# EAGLE design arduino adapter (EAGLE 5.03)
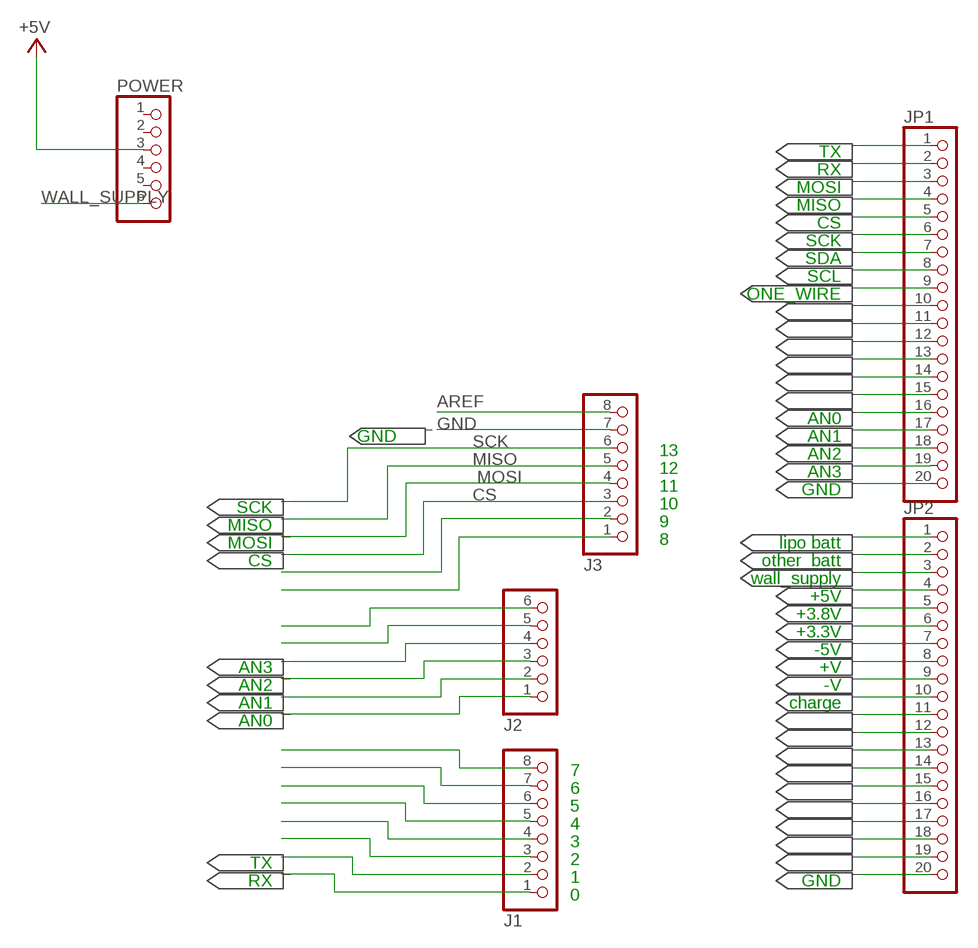
[diagram p0: schematic, sheet 1]

## Parts
J1  PINHD-1X8  [1X08]
J2  PINHD-1X6  [1X06]
J3  PINHD-1X8  [1X08]
JP1  PINHD-1X20  [1X20]
JP2  PINHD-1X20  [1X20]
POWER  PINHD-1X6  [1X06]

## Nets
+3.3V: JP2.6
+5V [usbvcc]: JP2.4 POWER.3
+V: JP2.8
-5V: JP2.7
-V: JP2.9
ALARM: JP1.14
AN0: J2.1 JP1.16
AN1: J2.2 JP1.17
AN2: J2.3 JP1.18
AN3: J2.4 JP1.19
AREF [aref]: J3.8
CD: JP1.10
CHARGE: JP2.10
CS: J3.3 JP1.5
GND [gnd]: J3.7 JP1.20 JP2.20
LOG: JP1.12
MISO: J3.5 JP1.4
MOSI: J3.4 JP1.3
N$1: JP2.11
N$4: JP2.12
N$5: J3.1
N$10: J1.3
N$11: J1.4
N$12: J1.5
N$13: J1.6
N$14: J1.7
N$15: J1.8
N$20: J2.5
N$21: J2.6
N$22: J3.2
N$23: JP2.13
N$28: JP2.14
N$29: JP2.15
N$30: JP2.16
N$31: JP2.17
N$33: JP2.18
N$41: JP2.19
N$42: JP1.15
ONE_WIRE: JP1.9
RIN: JP1.13
RX: J1.1 JP1.2
SCK: J3.6 JP1.6
SCL: JP1.8
SDA: JP1.7
SW: JP1.11
TX: J1.2 JP1.1
VCC1: JP2.5
VDD: JP2.1 JP2.2
WALL_SUPPLY: JP2.3 POWER.6
Unconnected: POWER.1 POWER.2 POWER.4 POWER.5

## Notes on the sheet
- TX
- RX
- MOSI
- MISO
- CS
- SCK
- SDA
- SCL
- ONE_WIRE
- AN0
- GND | AN1
- AN2
- 13
- AN3
- 12
- GND
- 11
- SCK
- 10
- MISO
- 9
- MOSI | lipo batt
- 8
- CS | other_batt
- wall_supply
- +5V
- +3.8V
- +3.3V
- -5V
- AN3 | +V
- AN2 | -V
- AN1 | charge
- AN0
- 7
- 6
- 5
- 4
- 3
- TX
- 2
- RX | GND
- 1
- 0

## Library data of the parts
J1 J3 = pinhead:PINHD-1X8: PIN HEADER
J2 POWER = pinhead:PINHD-1X6: PIN HEADER
JP1 JP2 = pinhead:PINHD-1X20: PIN HEADER

## Net classes
1 power: width 0.61 mm, drill 0.711 mm, clearance 0.33 mm
2 gnd: width 0.305 mm, drill 0.711 mm, clearance 0.254 mm
3 usbvcc: width 0.508 mm, drill 0.711 mm, clearance 0.254 mm
4 aref: width 0.406 mm

## Board
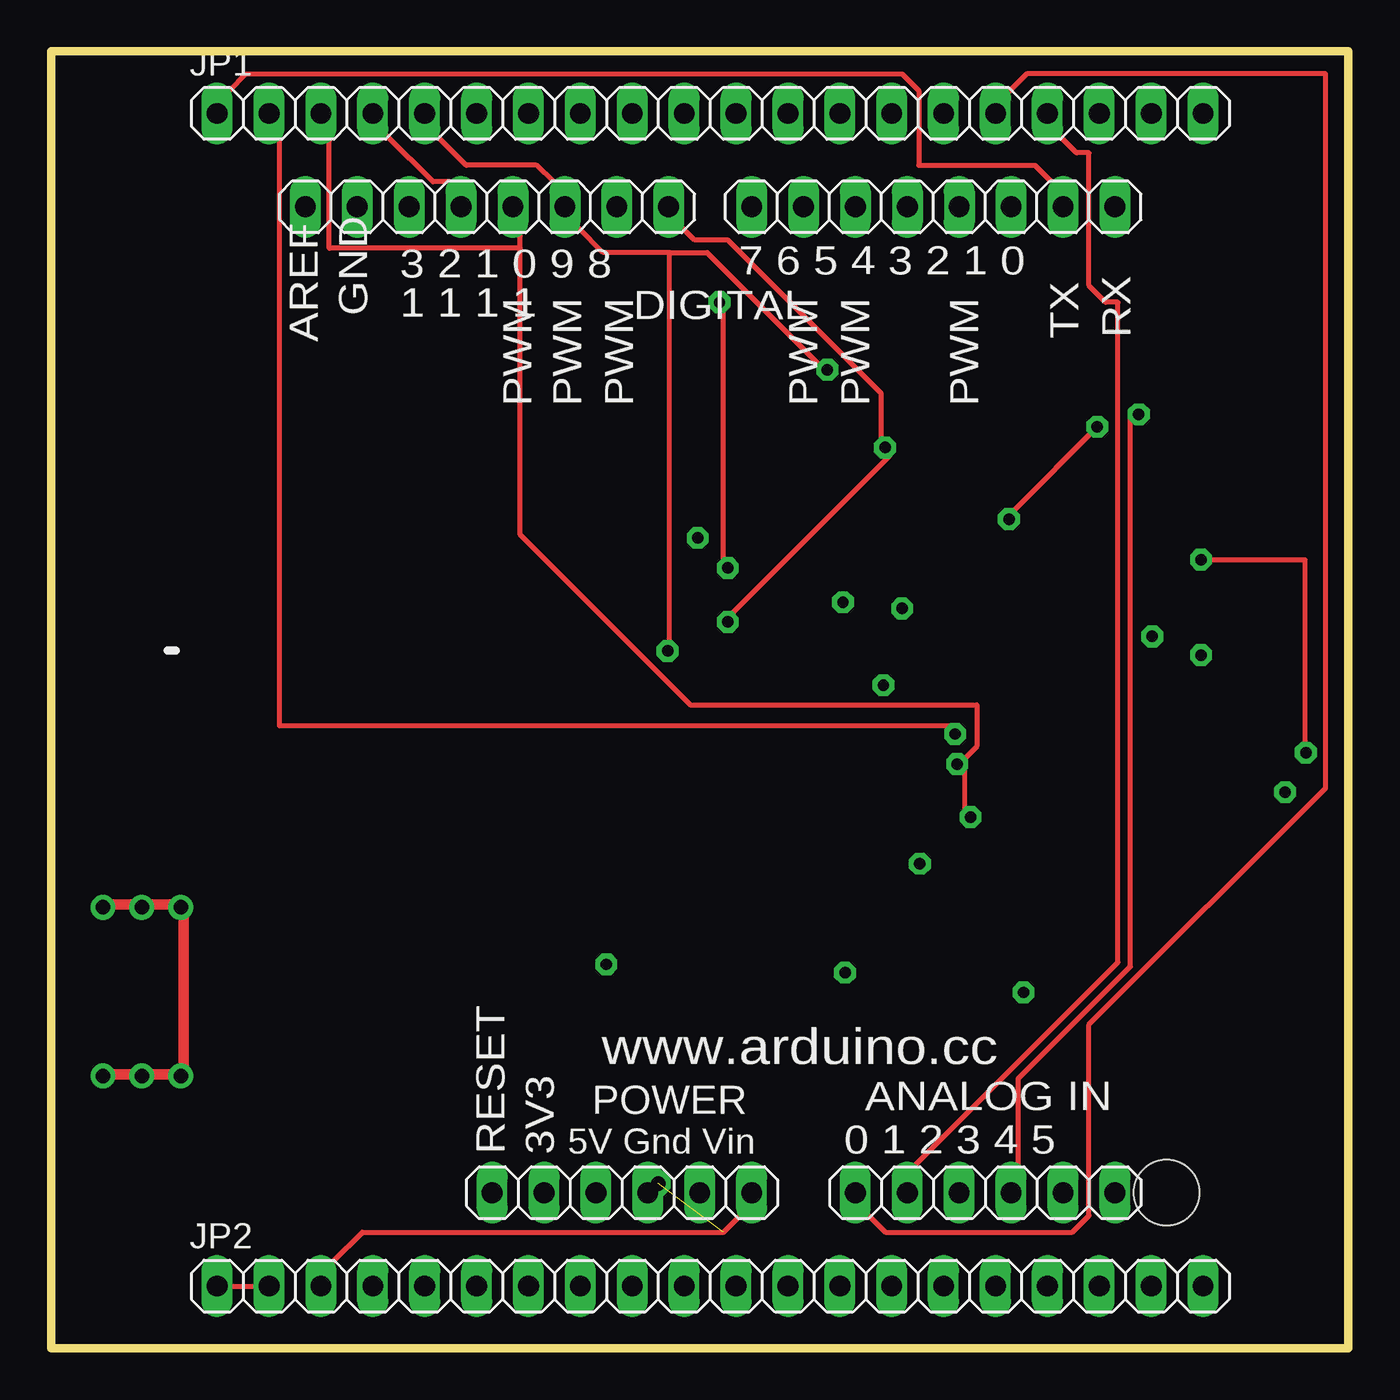
[diagram p1: board, top side]
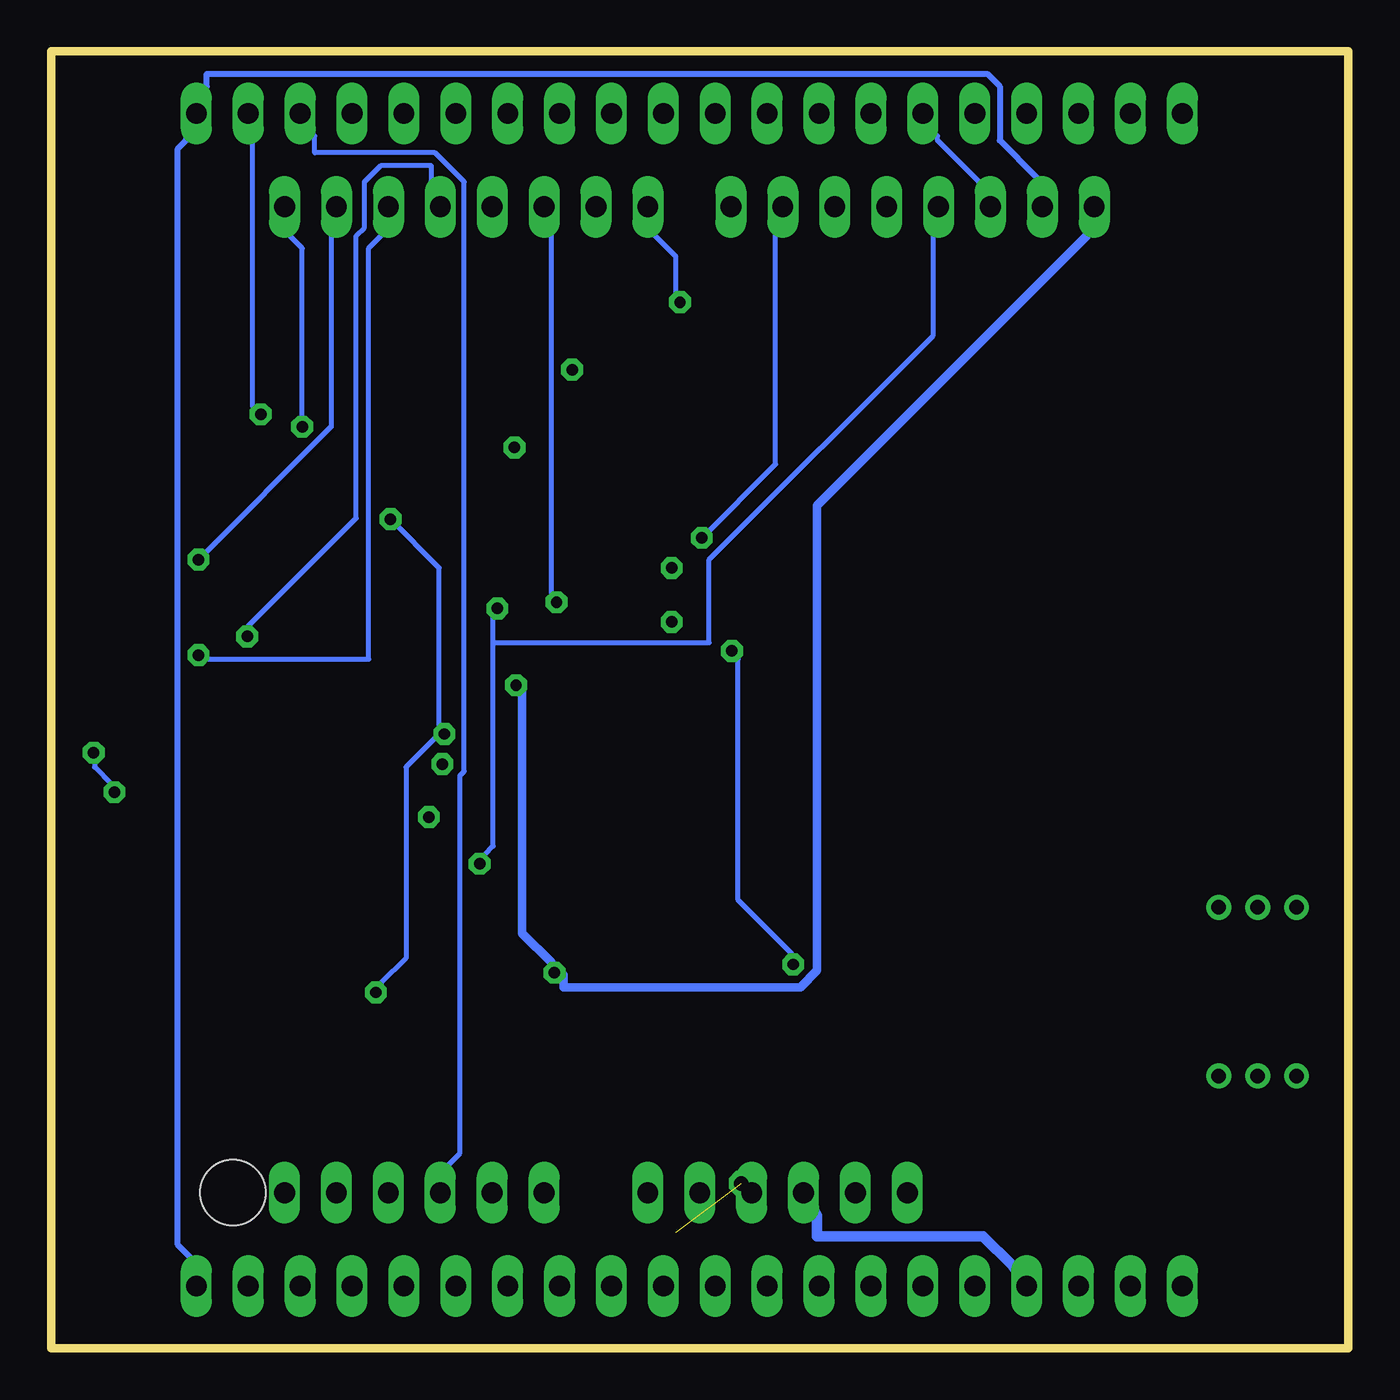
[diagram p2: board, bottom side, seen from below]

Size 63.5 x 63.5 mm. Coordinates in mm from the lower left corner, seen from the top.
Outline: 0,63.5 63.5,63.5 63.5,0 0,0 0,63.5
Copper layers (1*16): Top 0.035mm / dielectric 1.5mm / Bottom 0.035mm
Design rules "default": minimum track width 10mil, minimum drill 22mil, track to track 10mil, track to pad 10mil, pad to pad 10mil, via to via 16mil, smd to smd 8mil, copper to edge 30mil, drill to drill 12mil, minimum pad ring 10mil, minimum via ring 10mil, stop-mask expansion 4mil, vias tented up to drill 0mil, thermal gap 10mil
Holes 3.2 mm at 54.61,7.62
vRestrict: area 22.9,44.1 to 24.6,49.1; area 25.4,45.5 to 27.1,49.1; area 28.4,45.3 to 29.6,48.8; area 31,45.3 to 32.1,48.8; area 33.5,45.3 to 34.7,48.8; area 36.1,45.3 to 37.2,48.8; area 38.7,47.2 to 39.9,48.8; area 40.3,45.1 to 47.6,46.9; area 33.4,41 to 34.9,44.6; area 35.9,41 to 37.5,44.6; area 38.5,41 to 40,44.6; area 47.5,41 to 49,44.6; 37 more areas

### Footprints (pad centres in the part's own frame; a part is rotated, then mirrored left to right if it is on the bottom)
1X08 = drill 1.016 long: 1 -8.89,0; 2 -6.35,0; 3 -3.81,0; 4 -1.27,0; 5 1.27,0; 6 3.81,0; 7 6.35,0; 8 8.89,0
1X06 = drill 1.016 long: 1 -6.35,0; 2 -3.81,0; 3 -1.27,0; 4 1.27,0; 5 3.81,0; 6 6.35,0
1X20 = drill 1.016 long: 1 -24.13,0; 2 -21.59,0; 3 -19.05,0; 4 -16.51,0; 5 -13.97,0; 6 -11.43,0; 7 -8.89,0; 8 -6.35,0; 9 -3.81,0; 10 -1.27,0; 11 1.27,0; 12 3.81,0; 13 6.35,0; 14 8.89,0; 15 11.43,0; 16 13.97,0; 17 16.51,0; 18 19.05,0; 19 21.59,0; 20 24.13,0

### Placement (x,y rotation side)
J1  43.18,55.88 180 top
J2  45.72,7.62 0 top
J3  21.34,55.88 180 top
JP1  32.26,60.45 0 top
JP2  32.26,3.05 0 top
POWER  27.94,7.62 0 top

### Tracks (layer width: path | path; a pad name or v marks a point on that pad's centre or on a via)
+5V
  Bottom 0.508: JP2.4 16.46,4.06 17.88,5.49 26.01,5.49 26.01,6.5 POWER.3
AN0
  Top 0.254: J2.1 40.03,6.5 40.84,5.69 49.99,5.69 50.8,6.5 50.8,15.85 62.38,27.43 62.38,62.38 47.75,62.38 46.94,61.57 JP1.16
AN1
  Top 0.254: J2.2 42.27,8.94 52.22,18.9 52.22,51.21 51.61,51.21 50.8,52.02 50.8,58.52 50.19,58.52 49.38,59.33 JP1.17
AN2
  Bottom 0.254: J2.3 44.09,8.94 43.48,9.55 43.48,28.04 43.28,28.25 43.28,57.1 44.7,58.52 50.6,58.52 50.6,59.33 JP1.18
AN3  (via drill 0.56)
  Top 0.254: v53.24,45.72 52.83,45.72 52.83,18.69 47.35,13.21 47.35,8.94 J2.4
  Bottom 0.254: v53.24,45.72 53.65,46.13 53.65,59.13 JP1.19
AREF  (via drill 0.56)
  Bottom 0.406: v40.74,32.46 40.44,32.11 40.44,20.32 39.01,18.9 v38.86,18.39 38.41,18.29 38.41,17.68 26.82,17.68 26.01,18.49 26.01,41.25 12.8,54.46 J3.8
CS  (via drill 0.56)
  Top 0.254: 30.28,53.65 27.03,53.65 25.81,54.86 J3.3 24.59,57.1 23.77,57.91 20.32,57.91 18.9,59.33 JP1.5 | 30.28,53.65 32.11,53.65 37.59,48.16 v38,47.9 | 30.28,53.65 30.28,34.54 v30.18,34.14
  Bottom 0.254: v27.18,18.8 27.23,19.3 29.87,21.95 29.87,33.73 v30.18,34.14
GND
  Bottom 0.305: JP2.20 56.69,4.47 57.3,5.08 57.3,58.73 56.9,59.13 JP1.20 55.88,61.77 55.88,62.38 17.68,62.38 17.07,61.77 17.07,59.13 15.24,57.3 J3.7
MISO  (via drill 0.56)
  Top 0.254: JP1.4 16.46,59.33 18.69,57.1 19.51,57.1 J3.5
  Bottom 0.254: 41.86,34.54 41.86,35.76 v41.66,36.22 | 41.86,34.54 41.86,24.59 42.27,24.18 v42.52,23.72 | 41.86,34.54 31.29,34.54 31.29,38.61 20.32,49.58 20.32,54.46 J3.5
MOSI  (via drill 0.56)
  Top 0.254: v45.01,26.01 44.7,26.42 44.7,28.25 v44.35,28.6 44.7,28.85 45.31,29.46 45.31,31.5 31.29,31.5 22.96,39.83 22.96,53.85 | 22.96,53.85 22.96,54.46 J3.4 | 22.96,53.85 13.61,53.85 13.61,59.13 JP1.3
N$5  (via drill 0.56)
  Top 0.254: v33.12,35.56 33.33,35.97 41.05,43.69 v40.82,44.09 40.64,44.5 40.64,46.74 33.12,54.25 31.5,54.25 30.89,54.86 J3.1
N$10  (via drill 0.56)
  Bottom 0.254: v56.29,33.93 55.88,33.73 47.95,33.73 47.95,53.85 47.35,54.46 J1.3
N$11  (via drill 0.56)
  Bottom 0.254: v53.9,34.85 53.85,35.36 48.56,40.64 48.56,54.46 48.16,54.86 48.16,57.1 47.35,57.91 44.91,57.91 44.91,57.1 J1.4
N$13  (via drill 0.56)
  Bottom 0.254: v38.76,36.52 39.01,36.98 39.01,54.46 J1.6
N$15  (via drill 0.56)
  Top 0.254: v33.12,38.2 32.92,38.61 32.92,50.8 v32.72,51.21
  Bottom 0.254: J1.8 33.93,54.46 32.92,53.44 32.92,51.61 v32.72,51.21
N$22  (via drill 0.56)
  Bottom 0.254: v31.65,39.67 28.04,43.28 28.04,54.46 J3.2
RX  (via drill 0.56)
  Top 0.254: v51.21,45.11 47.14,41.05 v46.89,40.59 | JP1.2 11.18,59.13 11.18,30.48 44.09,30.48 v44.25,30.07
  Bottom 0.254: v47.6,17.42 47.35,17.88 46.13,19.1 46.13,28.45 44.7,29.87 v44.25,30.07 44.5,30.48 44.5,38.2 v46.89,40.59 | v51.21,45.11 51.21,53.85 51.82,54.46 J1.1
SCK
  Bottom 0.254: J3.6 18.09,57.1 20.12,59.13 20.12,59.33 JP1.6
TX  (via drill 0.56)
  Top 0.254: v56.29,38.61 61.37,38.61 61.37,29.67 v61.42,29.16 | JP1.1 8.74,61.57 9.55,62.38 41.66,62.38 42.47,61.57 42.47,57.91 48.16,57.91 48.97,57.1 J1.2
  Bottom 0.254: v60.4,27.23 60.55,27.64 61.37,28.45 61.37,28.65 v61.42,29.16 | v56.29,38.61 49.78,45.11 49.78,54.46 J1.2
VCC  (via drill 0.71)
  Top 0.508: v2.54,13.34 3.05,13.41 3.86,13.41 v4.45,13.34 4.88,13.41 5.89,13.41 v6.35,13.34 6.5,13.82 6.5,21.13 v6.35,21.59 5.89,21.74 4.88,21.74 v4.45,21.59 3.86,21.74 3.05,21.74 v2.54,21.59
VDD
  Top 0.254: JP2.1 JP2.2
WALL_SUPPLY  (via drill 0.71)  (1 unrouted)
  Top 0.254: JP2.3 13.82,4.27 15.24,5.69 32.92,5.69 33.73,6.5 POWER.6
  other vias: 29.72,8.08

### Text on the board
tNames: 7 6 5 4 3 2 1 0 | 3 2 1 0 9 8 | GND | 1 1 1 1 | DIGITAL | AREF | TX | RX | PWM | PWM | PWM | PWM | PWM | PWM | www.arduino.cc | ANALOG IN | RESET | 3V3 | 5V Gnd Vin | 0 1 2 3 4 5
tStop: MADE IN | ITALY
Reference: C8 | R7 | R10 | R8 | R9 | C3 | C2 | R12 | R11 | R1 | R2 | C1 | R3 | C4 | C5 | X2 | C7 | C6